# EAGLE schematic moire (EAGLE 9.1.1)

## Sheet 1 of 2
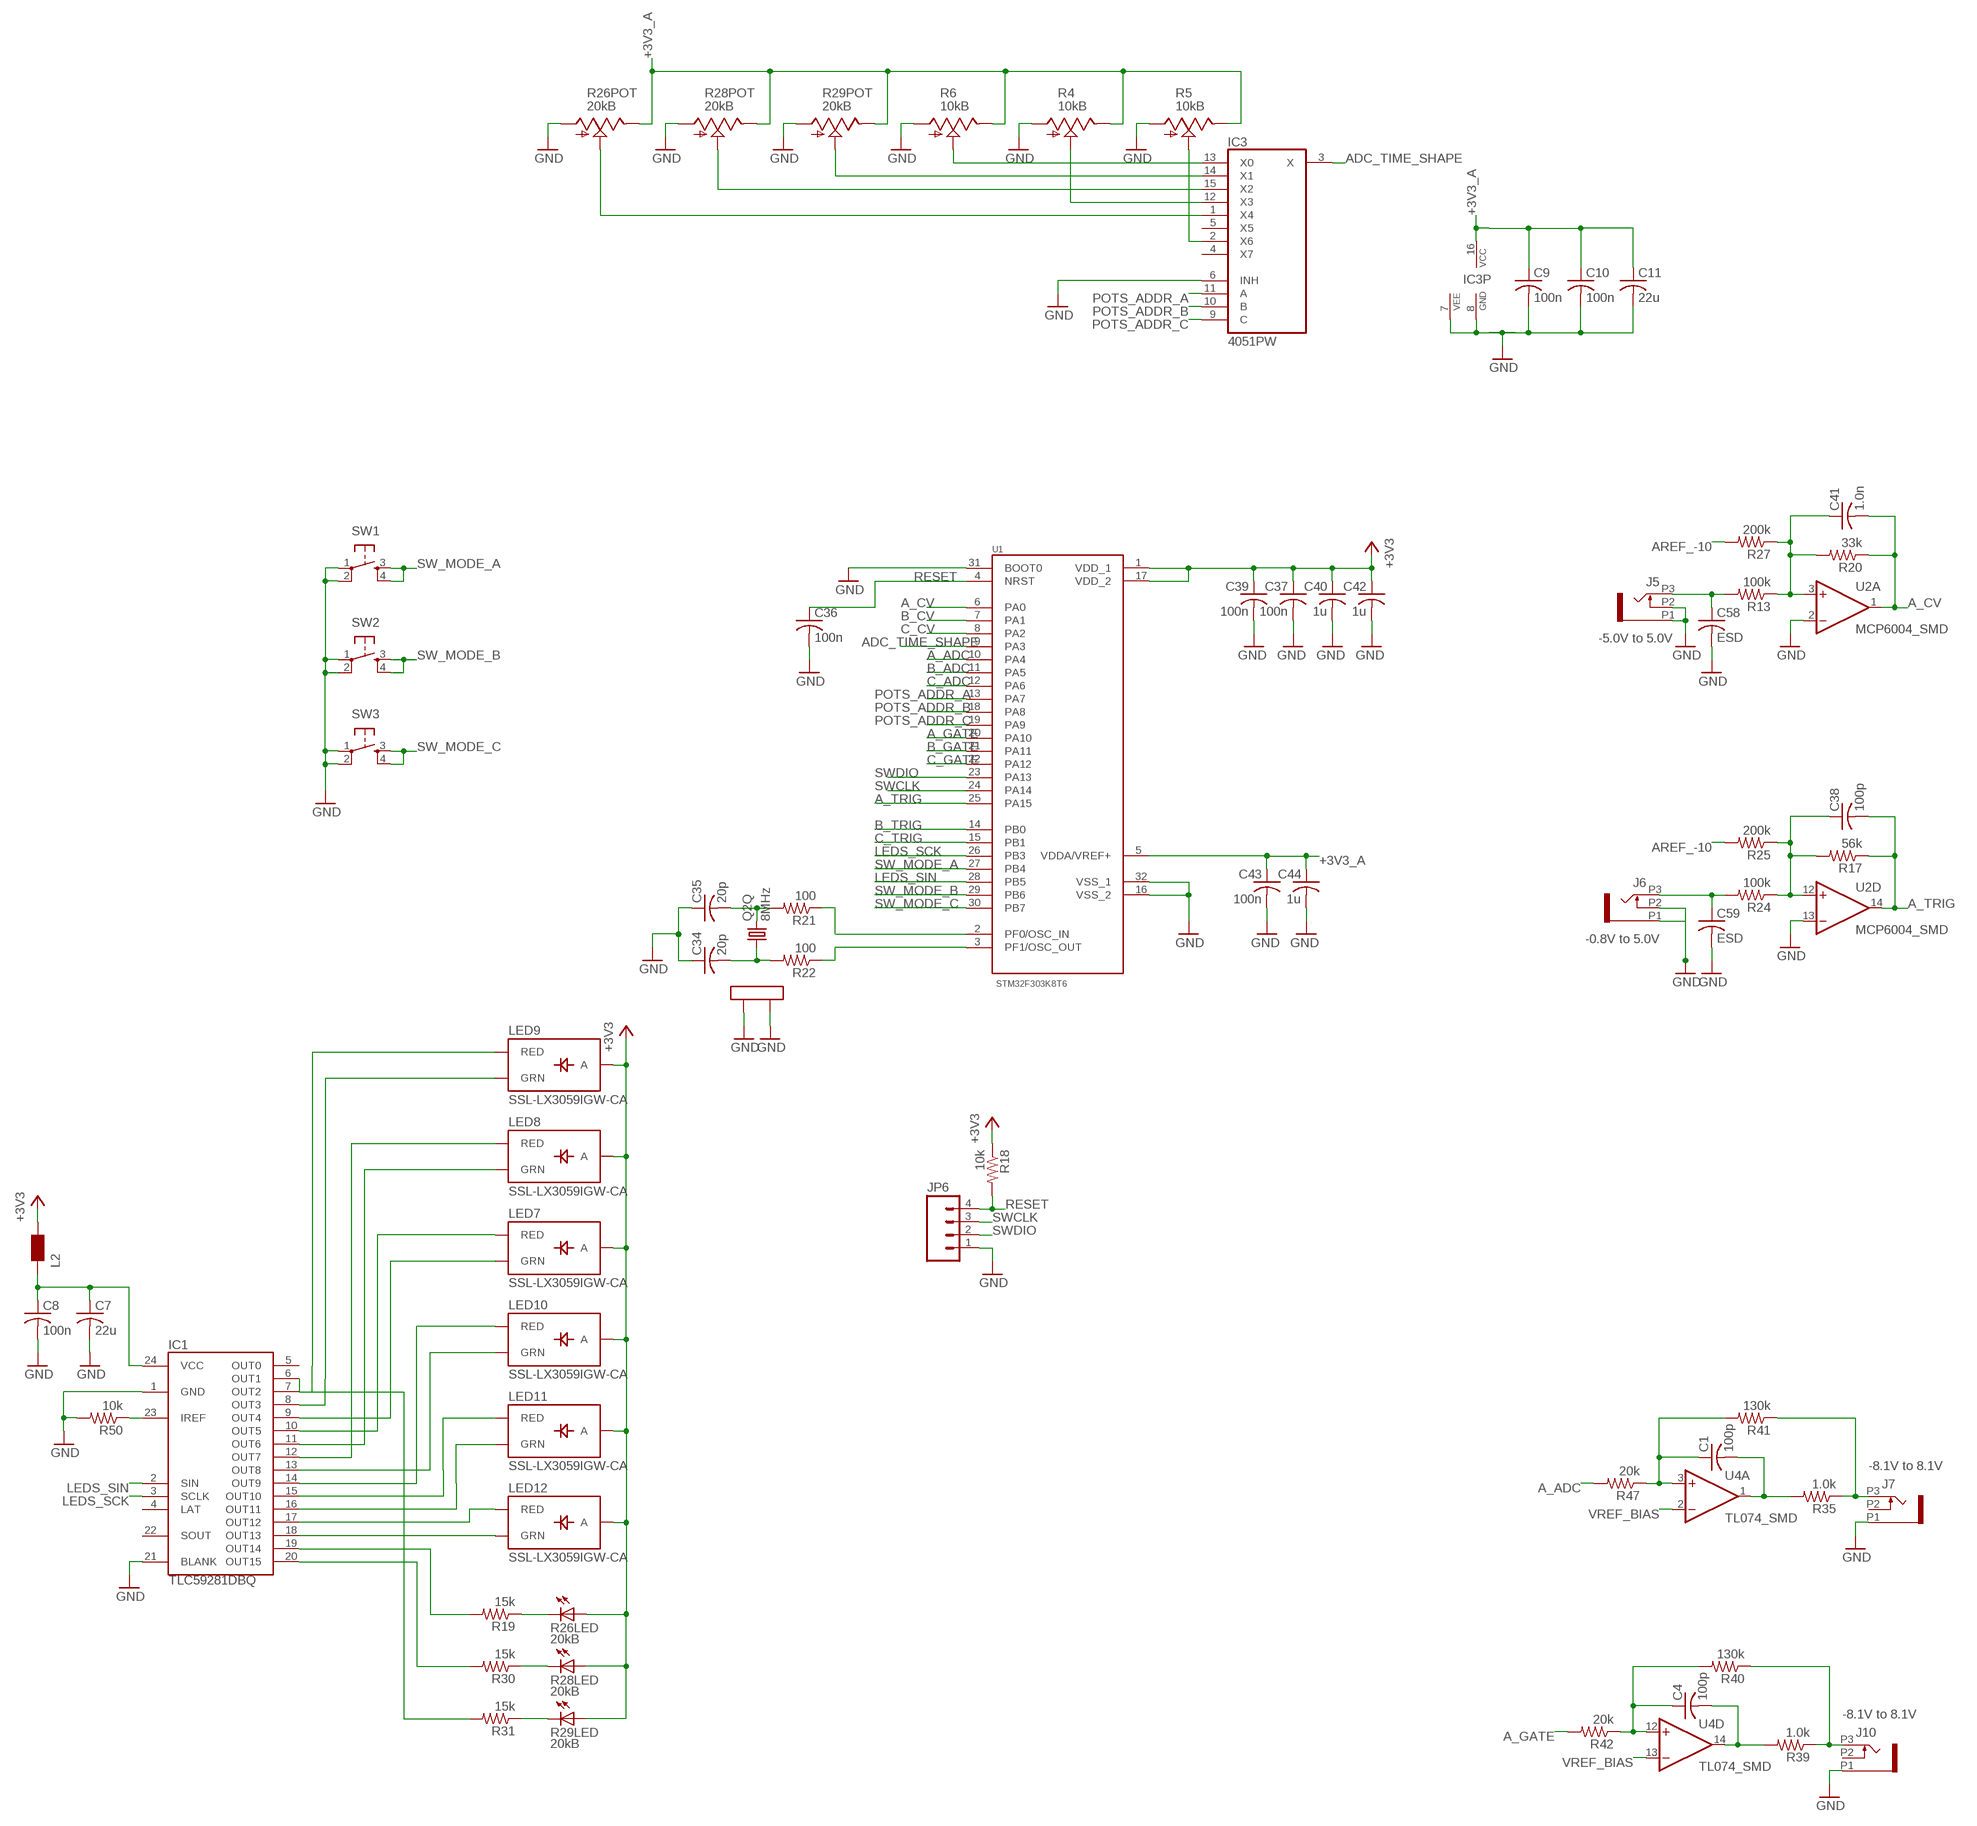
[diagram p0: schematic, sheet 1, part 1 of 2]
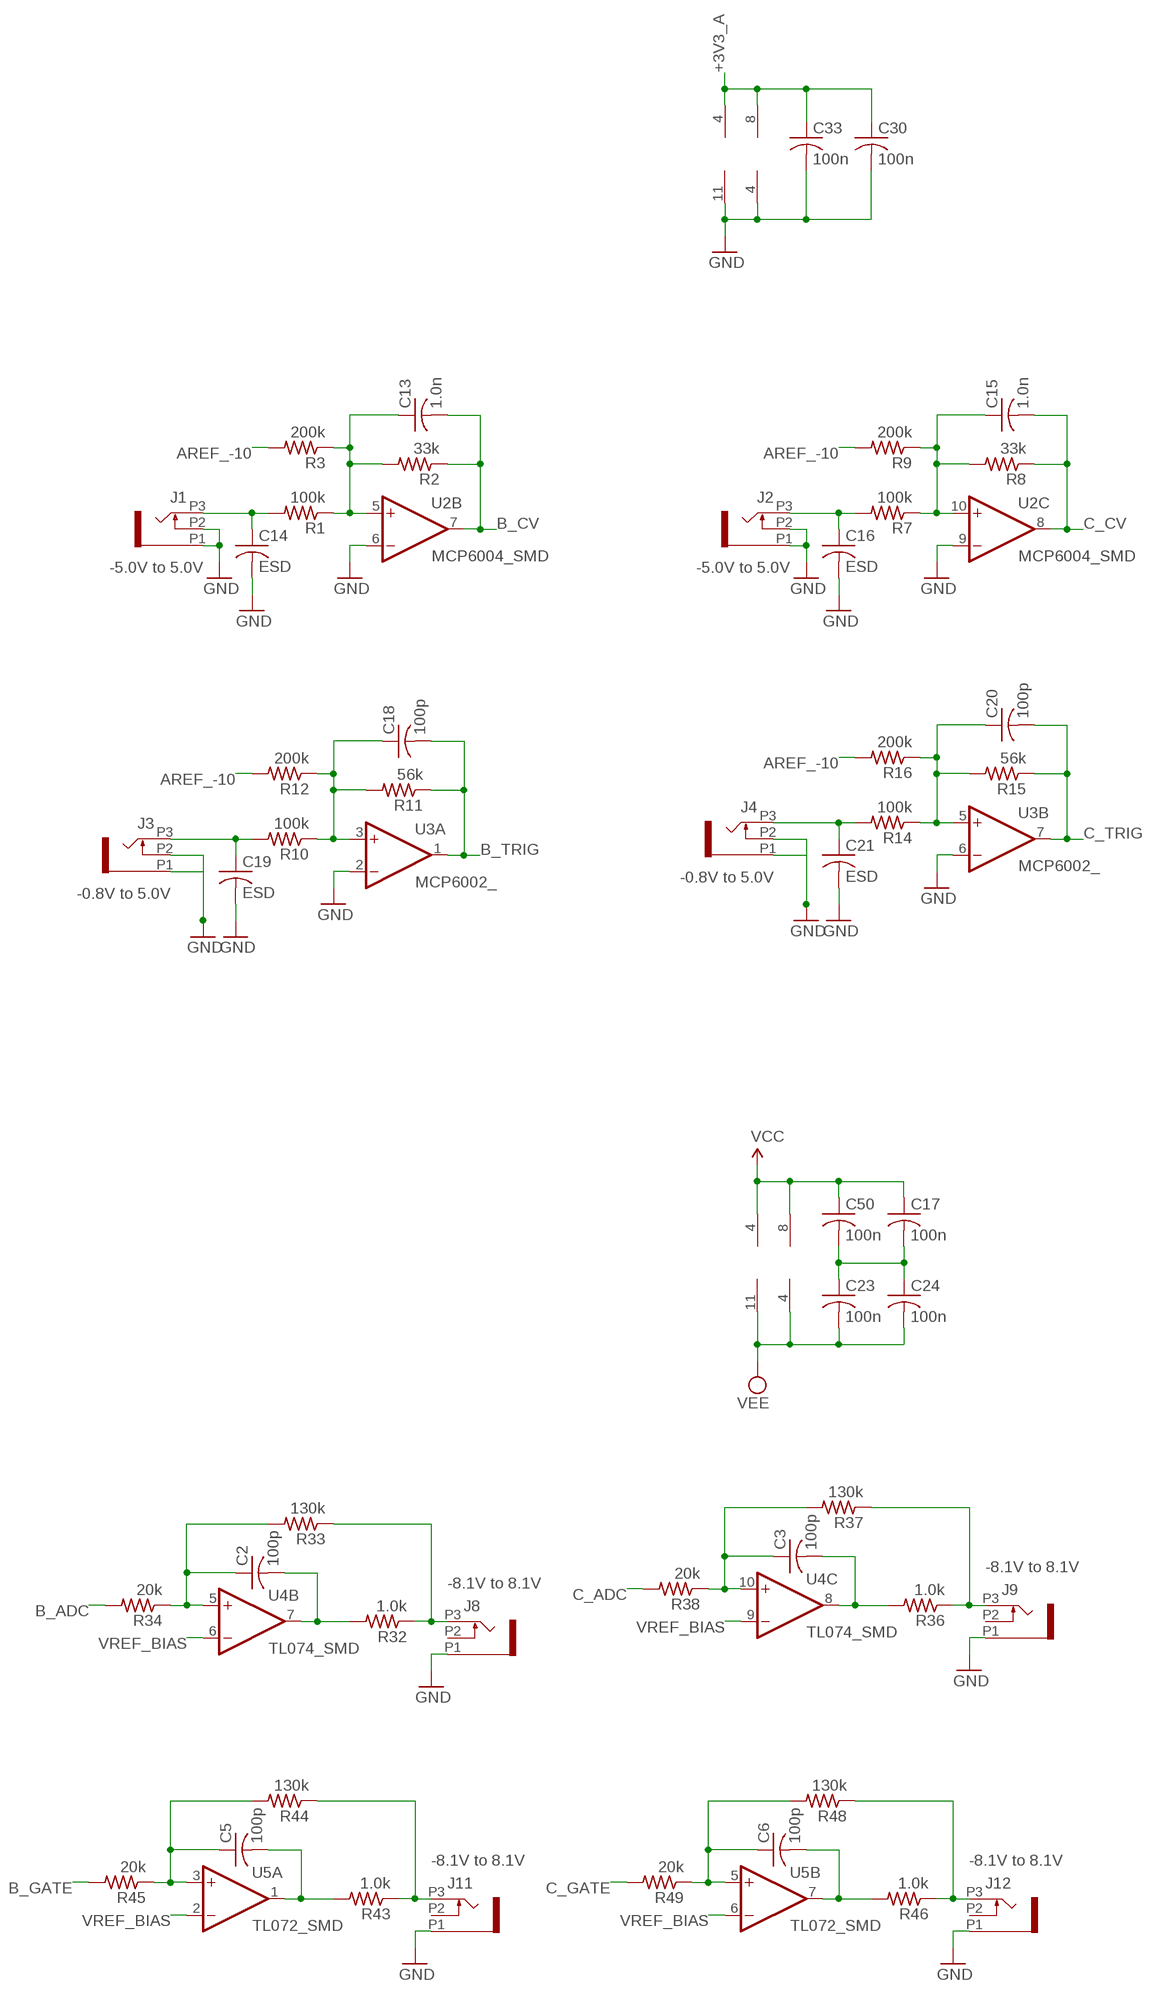
[diagram p1: schematic, sheet 1, part 2 of 2]

### Parts
C1  100p  C-USC0402  [C0402]
C2  100p  C-USC0402  [C0402]
C3  100p  C-USC0402  [C0402]
C4  100p  C-USC0402  [C0402]
C5  100p  C-USC0402  [C0402]
C6  100p  C-USC0402  [C0402]
C7  22u  C-USC1206  [C1206]
C8  100n  C-USC0402  [C0402]
C9  100n  C-USC0402  [C0402]
C10  100n  C-USC0402  [C0402]
C11  22u  C-USC1206  [C1206]
C13  1.0n  C-USC0402  [C0402]
C14  ESD  C-USC0603  [C0603]
C15  1.0n  C-USC0402  [C0402]
C16  ESD  C-USC0603  [C0603]
C17  100n  C-USC0402  [C0402]
C18  100p  C-USC0402  [C0402]
C19  ESD  C-USC0603  [C0603]
C20  100p  C-USC0402  [C0402]
C21  ESD  C-USC0603  [C0603]
C23  100n  C-USC0402  [C0402]
C24  100n  C-USC0402  [C0402]
C30  100n  C-USC0402  [C0402]
C33  100n  C-USC0402  [C0402]
C34  20p  C-USC0402  [C0402]
C35  20p  C-USC0402  [C0402]
C36  100n  C-USC0402  [C0402]
C37  100n  C-USC0402  [C0402]
C38  100p  C-USC0402  [C0402]
C39  100n  C-USC0402  [C0402]
C40  1u  C-USC0402  [C0402]
C41  1.0n  C-USC0402  [C0402]
C42  1u  C-USC0402  [C0402]
C43  100n  C-USC0402  [C0402]
C44  1u  C-USC0402  [C0402]
C50  100n  C-USC0402  [C0402]
C58  ESD  C-USC0603  [C0603]
C59  ESD  C-USC0603  [C0603]
IC1  TLC59281DBQ  [TSSOP24_0635]
IC3  4051PW  [TSSOP16_065]
J1  PJ301_THONKICONN6  [WQP_PJ_301M6]
J2  PJ301_THONKICONN6  [WQP_PJ_301M6]
J3  PJ301_THONKICONN6  [WQP_PJ_301M6]
J4  PJ301_THONKICONN6  [WQP_PJ_301M6]
J5  PJ301_THONKICONN6  [WQP_PJ_301M6]
J6  PJ301_THONKICONN6  [WQP_PJ_301M6]
J7  PJ301_THONKICONN6  [WQP_PJ_301M6]
J8  PJ301_THONKICONN6  [WQP_PJ_301M6]
J9  PJ301_THONKICONN6  [WQP_PJ_301M6]
J10  PJ301_THONKICONN6  [WQP_PJ_301M6]
J11  PJ301_THONKICONN6  [WQP_PJ_301M6]
J12  PJ301_THONKICONN6  [WQP_PJ_301M6]
JP6  M04PTH  [1X04]
L2  WE-CBF_0603  [0603]
LED7  SSL-LX3059IGW-CA  LED-BICOLOR-THROUGHHOLE-CA  [LED-BICOLOR-THROUGHHOLE-LUMEX]
LED8  SSL-LX3059IGW-CA  LED-BICOLOR-THROUGHHOLE-CA  [LED-BICOLOR-THROUGHHOLE-LUMEX]
LED9  SSL-LX3059IGW-CA  LED-BICOLOR-THROUGHHOLE-CA  [LED-BICOLOR-THROUGHHOLE-LUMEX]
LED10  SSL-LX3059IGW-CA  LED-BICOLOR-THROUGHHOLE-CA  [LED-BICOLOR-THROUGHHOLE-LUMEX]
LED11  SSL-LX3059IGW-CA  LED-BICOLOR-THROUGHHOLE-CA  [LED-BICOLOR-THROUGHHOLE-LUMEX]
LED12  SSL-LX3059IGW-CA  LED-BICOLOR-THROUGHHOLE-CA  [LED-BICOLOR-THROUGHHOLE-LUMEX]
Q2  8MHz  CRYSTAL  [CTS406]
R1  100k  R-US_R0402  [R0402]
R2  33k  R-US_R0402  [R0402]
R3  200k  R-US_R0402  [R0402]
R4  10kB  POT_USVERTICAL_PS  [ALPS_POT_VERTICAL_PS]
R5  10kB  POT_USVERTICAL_PS  [ALPS_POT_VERTICAL_PS]
R6  10kB  POT_USVERTICAL_PS  [ALPS_POT_VERTICAL_PS]
R7  100k  R-US_R0402  [R0402]
R8  33k  R-US_R0402  [R0402]
R9  200k  R-US_R0402  [R0402]
R10  100k  R-US_R0402  [R0402]
R11  56k  R-US_R0402  [R0402]
R12  200k  R-US_R0402  [R0402]
R13  100k  R-US_R0402  [R0402]
R14  100k  R-US_R0402  [R0402]
R15  56k  R-US_R0402  [R0402]
R16  200k  R-US_R0402  [R0402]
R17  56k  R-US_R0402  [R0402]
R18  10k  R-US_R0402  [R0402]
R19  15k  R-US_R0402  [R0402]
R20  33k  R-US_R0402  [R0402]
R21  100  R-US_R0402  [R0402]
R22  100  R-US_R0402  [R0402]
R24  100k  R-US_R0402  [R0402]
R25  200k  R-US_R0402  [R0402]
R26  20kB  BOURNS_SLIDER  [BOURNS_SLIDER]
R27  200k  R-US_R0402  [R0402]
R28  20kB  BOURNS_SLIDER  [BOURNS_SLIDER]
R29  20kB  BOURNS_SLIDER  [BOURNS_SLIDER]
R30  15k  R-US_R0402  [R0402]
R31  15k  R-US_R0402  [R0402]
R32  1.0k  R-US_R0603  [R0603]
R33  130k  R-US_R0402  [R0402]
R34  20k  R-US_R0402  [R0402]
R35  1.0k  R-US_R0603  [R0603]
R36  1.0k  R-US_R0603  [R0603]
R37  130k  R-US_R0402  [R0402]
R38  20k  R-US_R0402  [R0402]
R39  1.0k  R-US_R0603  [R0603]
R40  130k  R-US_R0402  [R0402]
R41  130k  R-US_R0402  [R0402]
R42  20k  R-US_R0402  [R0402]
R43  1.0k  R-US_R0603  [R0603]
R44  130k  R-US_R0402  [R0402]
R45  20k  R-US_R0402  [R0402]
R46  1.0k  R-US_R0603  [R0603]
R47  20k  R-US_R0402  [R0402]
R48  130k  R-US_R0402  [R0402]
R49  20k  R-US_R0402  [R0402]
R50  10k  R-US_R0402  [R0402]
SW1  TAC_SWITCHPTH  [TACTILE-PTH]
SW2  TAC_SWITCHPTH  [TACTILE-PTH]
SW3  TAC_SWITCHPTH  [TACTILE-PTH]
U1  STM32F303K8T6  [QFP80P900X900X160-32N]
U2  MCP6004_SMD  [SO14]
U3  MCP6002_  [SO08]
U4  TL074_SMD  [SO14]
U5  TL072_SMD  [SO08]

### Nets
+3V1: C37.1 C39.1 C40.1 C42.1 U1.1(VDD_1) U1.17(VDD_2) ; supply symbol labelled +3V3
+3V3: L2.2 LED7.A LED8.A LED9.A LED10.A LED11.A LED12.A R18.1 R26.B(LED:A) R28.B(LED:A) R29.B(LED:A) ; also sheet 2
+3V3_A: C9.1 C10.1 C11.1 C30.1 C33.1 C43.1 C44.1 IC3.16(VCC) R4.P$1(E) R5.P$1(E) R6.P$1(E) R26.3(POT:E) R28.3(POT:E) R29.3(POT:E) U1.5(VDDA/VREF+) U2.4(P:V+) U3.8(P:V+) ; also sheet 2
A_ADC: R47.2 U1.10(PA4)
A_CV: C41.2 R20.1 U1.6(PA0) U2.1(A:OUT)
A_GATE: R42.2 U1.20(PA10)
A_TRIG: C38.2 R17.1 U1.25(PA15) U2.14(D:OUT)
ADC_TIME_SHAPE: IC3.3(X) U1.9(PA3)
AREF_-10: R3.2 R9.2 R12.2 R16.2 R25.2 R27.2 ; also sheet 2
B_ADC: R34.2 U1.11(PA5)
B_CV: C13.2 R2.1 U1.7(PA1) U2.7(B:OUT)
B_GATE: R45.2 U1.21(PA11)
B_TRIG: C18.2 R11.1 U1.14(PB0) U3.1(A:OUT)
C_ADC: R38.2 U1.12(PA6)
C_CV: C15.2 R8.1 U1.8(PA2) U2.8(C:OUT)
C_GATE: R49.2 U1.22(PA12)
C_TRIG: C20.2 R15.1 U1.15(PB1) U3.7(B:OUT)
GATE_IN1: C59.1 J6.P3 R24.2
GATE_IN2: C19.1 J3.P3 R10.2
GATE_IN3: C21.1 J4.P3 R14.2
GND: C7.2 C8.2 C9.2 C10.2 C11.2 C14.2 C16.2 C19.2 C21.2 C30.2 C33.2 C34.1 C35.1 C36.2 C37.2 C39.2 C40.2 C42.2 C43.2 C44.2 C58.2 C59.2 IC1.1(GND) IC1.21(BLANK) IC3.6(INH) IC3.7(VEE) IC3.8(GND) J1.P1 J1.P2 J2.P1 J2.P2 J3.P1 J3.P2 J4.P1 J4.P2 J5.P1 J5.P2 J6.P1 J6.P2 J7.P1 J8.P1 J9.P1 J10.P1 J11.P1 J12.P1 JP6.1 Q2.2(LID1) Q2.4(LID2) R4.P$3(A) R5.P$3(A) R6.P$3(A) R26.1(POT:A) R28.1(POT:A) R29.1(POT:A) R50.2 SW1.1 SW1.2 SW2.1 SW2.2 SW3.1 SW3.2 U1.16(VSS_2) U1.31(BOOT0) U1.32(VSS_1) U2.2(A:-IN) U2.6(B:-IN) U2.9(C:-IN) U2.11(P:V-) U2.13(D:-IN) U3.2(A:-IN) U3.4(P:V-) U3.6(B:-IN) ; also sheet 2
HARMONICS_IN: C58.1 J5.P3 R13.2
HARMONICS_IN1: C14.1 J1.P3 R1.2
HARMONICS_IN2: C16.1 J2.P3 R7.2
LEDS_SCK: IC1.3(SCLK) U1.26(PB3)
LEDS_SIN: IC1.2(SIN) U1.28(PB5)
N$1: R29.E(LED:C) R31.1
N$2: C13.1 R1.1 R2.2 R3.1 U2.5(B:+IN)
N$3: C15.1 R7.1 R8.2 R9.1 U2.10(C:+IN)
N$4: C18.1 R10.1 R11.2 R12.1 U3.3(A:+IN)
N$5: C38.1 R17.2 R24.1 R25.1 U2.12(D:+IN)
N$6: C20.1 R14.1 R15.2 R16.1 U3.5(B:+IN)
N$7: J8.P3 R32.1 R33.1
N$8: C2.1 R33.2 R34.1 U4.5(B:+IN)
N$9: R21.1 U1.2(PF0/OSC_IN)
N$10: R22.1 U1.3(PF1/OSC_OUT)
N$11: C35.2 Q2.3 R21.2
N$12: C34.2 Q2.1 R22.2
N$19: C2.2 R32.2 U4.7(B:OUT)
N$20: J9.P3 R36.1 R37.1
N$21: C3.1 R37.2 R38.1 U4.10(C:+IN)
N$22: C3.2 R36.2 U4.8(C:OUT)
N$23: J10.P3 R39.1 R40.1
N$24: C4.1 R40.2 R42.1 U4.12(D:+IN)
N$25: C4.2 R39.2 U4.14(D:OUT)
N$26: J11.P3 R43.1 R44.1
N$27: C5.1 R44.2 R45.1 U5.3(A:+IN)
N$28: C5.2 R43.2 U5.1(A:OUT)
N$29: J12.P3 R46.1 R48.1
N$30: C6.1 R48.2 R49.1 U5.5(B:+IN)
N$31: C6.2 R46.2 U5.7(B:OUT)
N$32: IC1.11(OUT6) LED8.GREEN_C(GRN)
N$33: IC1.10(OUT5) LED7.RED_C(RED)
N$34: IC1.12(OUT7) LED8.RED_C(RED)
N$35: IC1.7(OUT2) LED9.RED_C(RED)
N$36: IC1.8(OUT3) LED9.GREEN_C(GRN)
N$37: IC1.15(OUT10) LED11.RED_C(RED)
N$38: IC1.16(OUT11) LED11.GREEN_C(GRN)
N$39: IC1.13(OUT8) LED10.GREEN_C(GRN)
N$40: IC1.17(OUT12) LED12.RED_C(RED)
N$41: C41.1 R13.1 R20.2 R27.1 U2.3(A:+IN)
N$42: IC1.18(OUT13) LED12.GREEN_C(GRN)
N$43: IC1.14(OUT9) LED10.RED_C(RED)
N$44: C7.1 C8.1 IC1.24(VCC) L2.1
N$45: IC1.19(OUT14) R19.2
N$46: IC1.20(OUT15) R30.2
N$47: IC1.6(OUT1) R31.2
N$48: IC3.1(X4) R26.2(POT:S)
N$49: R28.E(LED:C) R30.1
N$50: R19.1 R26.E(LED:C)
N$51: IC3.2(X6) R5.P$2(S)
N$52: C17.2 C23.1 C24.1 C50.2
N$53: IC3.12(X3) R4.P$2(S)
N$54: IC3.13(X0) R6.P$2(S)
N$55: IC3.14(X1) R29.2(POT:S)
N$56: IC3.15(X2) R28.2(POT:S)
N$68: IC1.23(IREF) R50.1
N$86: J7.P3 R35.1 R41.1
N$87: C1.1 R41.2 R47.1 U4.3(A:+IN)
N$93: C1.2 R35.2 U4.1(A:OUT)
N$101: IC1.9(OUT4) LED7.GREEN_C(GRN)
POTS_ADDR_A: IC3.11(A) U1.13(PA7)
POTS_ADDR_B: IC3.10(B) U1.18(PA8)
POTS_ADDR_C: IC3.9(C) U1.19(PA9)
RESET: C36.1 JP6.4 R18.2 U1.4(NRST)
SW_MODE_A: SW1.3 SW1.4 U1.27(PB4)
SW_MODE_B: SW2.3 SW2.4 U1.29(PB6)
SW_MODE_C: SW3.3 SW3.4 U1.30(PB7)
SWCLK: JP6.3 U1.24(PA14)
SWDIO: JP6.2 U1.23(PA13)
VCC: C17.1 C50.1 U4.4(P:V+) U5.8(P:V+) ; also sheet 2
VEE: C23.2 C24.2 U4.11(P:V-) U5.4(P:V-) ; also sheet 2
VREF_BIAS: U4.2(A:-IN) U4.6(B:-IN) U4.9(C:-IN) U4.13(D:-IN) U5.2(A:-IN) U5.6(B:-IN)
Unconnected: IC1.4(LAT) IC1.5(OUT0) IC1.22(SOUT) IC3.4(X7) IC3.5(X5) J7.P2 J8.P2 J9.P2 J10.P2 J11.P2 J12.P2

### Notes on the sheet
- -5.0V to 5.0V
- -5.0V to 5.0V | -5.0V to 5.0V
- -0.8V to 5.0V
- -0.8V to 5.0V
- -0.8V to 5.0V
- -8.1V to 8.1V
- -8.1V to 8.1V | -8.1V to 8.1V
- -8.1V to 8.1V | -8.1V to 8.1V
- -8.1V to 8.1V

## Sheet 2 of 2
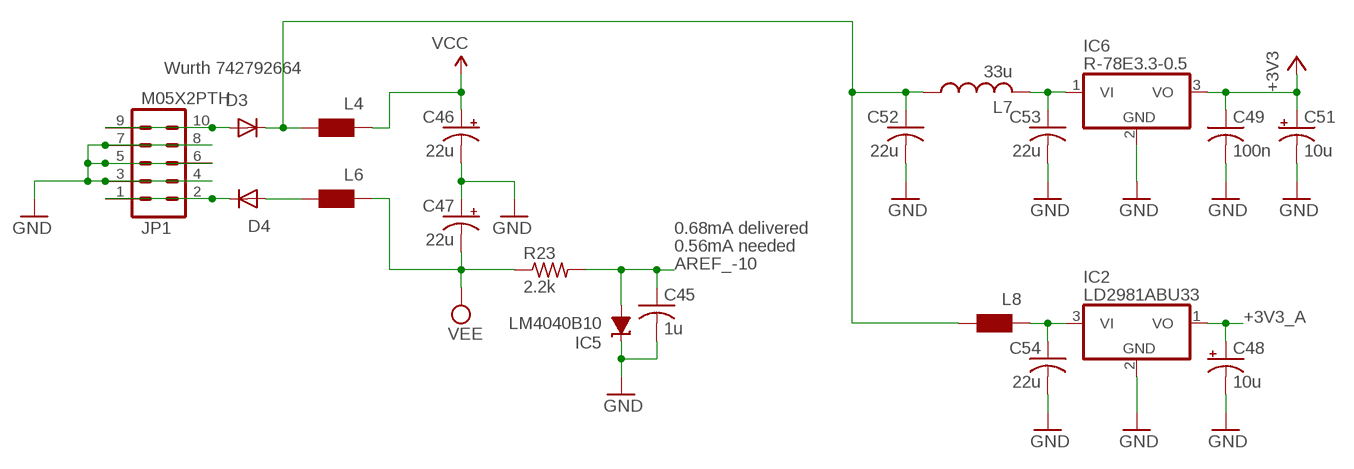
[diagram p2: schematic, sheet 2]

### Parts
C45  1u  C-USC0402  [C0402]
C46  22u  CPOL-USB  [PANASONIC_B]
C47  22u  CPOL-USB  [PANASONIC_B]
C48  10u  CPOL-USA  [PANASONIC_A]
C49  100n  C-USC0402  [C0402]
C51  10u  CPOL-USA  [PANASONIC_A]
C52  22u  C-USC1206  [C1206]
C53  22u  C-USC1206  [C1206]
C54  22u  C-USC1206  [C1206]
D3  1N5819HW  DIODE-SOD123  [SOD123]
D4  1N5819HW  DIODE-SOD123  [SOD123]
IC2  LD2981ABU33  LD2981ABU  [SOT89]
IC5  LM4040B10  LM4041B12DBZ  [DBZ_R-PDSO-G3]
IC6  R-78E3.3-0.5  WE173950378  [WE78]
JP1  M05X2PTH  [2X5-PTH]
L4  WE-CBF_0603  [0603]
L6  WE-CBF_0603  [0603]
L7  33u  L-USL2012C  [L2012C]
L8  WE-CBF_0603  [0603]
R23  2.2k  R-US_R0402  [R0402]

### Nets
+3V3: C49.1 C51.+ IC6.3(VO) ; also sheet 1
+3V3_A: C48.+ IC2.1(VO) ; also sheet 1
AREF_-10: C45.1 IC5.2(A) R23.2 ; also sheet 1
GND: C45.2 C46.- C47.+ C48.- C49.2 C51.- C52.2 C53.2 C54.2 IC2.2(GND) IC5.1(C) IC6.2(GND) JP1.3 JP1.4 JP1.5 JP1.6 JP1.7 JP1.8 ; also sheet 1
N$13: D3.A JP1.9 JP1.10
N$14: D4.C JP1.1 JP1.2
N$15: C53.1 IC6.1(VI) L7.2
N$16: D4.A L6.2
N$17: C52.1 D3.C L4.2 L7.1 L8.2
N$18: C54.1 IC2.3(VI) L8.1
VCC: C46.+ L4.1 ; also sheet 1
VEE: C47.- L6.1 R23.1 ; also sheet 1

### Notes on the sheet
- Wurth 742792664
- 0.68mA delivered
- 0.56mA needed

## Library data of the parts
C1-C11 C13-C21 C23 C24 C30 C33-C45 C49 C50 C52-C54 C58 C59 = rcl:C-US: CAPACITOR, American symbol
C46-C48 C51 = rcl:CPOL-US: POLARIZED CAPACITOR, American symbol
D3 D4 = diode:DIODE-: DIODE
IC1 = og-ics:TLC59281
IC2 = og-vreg:LD2981
IC3 = og-ics:4051: 8-channel ANALOG MULTIPLEXER
IC5 = texas:LM4041: PRECISION MICROPOWER SHUNT VOLTAGE REFERENCE Source: http://focus.ti.com/lit/ds/slcs146e/slcs146e.pdf
IC6 = og-vreg:WE173950378
J1-J12 = og-pj301_variations:PJ301_THONKICONN
JP1 = og-header:M05X2: Header 5x2 Standard 10-pin dual row 0.1" header. Commonly used with AVR-ISP. Use with Spark Fun Electronics SKU: PRT-00778
JP6 = SparkFun:M04: Header 4 Standard 4-pin 0.1" header. Use with straight break away headers (SKU : PRT-00116), right angle break away headers (PRT-00553), swiss pins (PRT-00743), machine pins (PRT-00117), and female headers (PRT-00115). Molex polarized connector foot print use with SKU : PRT-08231 with associated crimp pins and housings.
L2 L4 L6 L8 = wuerth-elektronik:WE-CBF: SMD EMI Suppression Ferrite Beads - excellent anti-EMI properties - low DCR - impedances till 3000 ohms - rated current up to 6 A
L7 = og-rcl:L-US
LED7-LED12 = og-leds:LED-BICOLOR-THROUGHHOLE-CA
Q2 = og-crystal:CRYSTAL: Crystal with 2 extra terminals for the metal LID (Abracon ABMM2 for example)
R1-R3 R7-R25 R27 R30-R50 = rcl:R-US_: RESISTOR, American symbol
R4-R6 = og-pots:POT_US
R26 R28 R29 = og-pots:BOURNS_SLIDER
SW1-SW3 = SparkFun:TAC_SWITCH: Momentary Switch Button commonly used for reset or general input. Spark Fun Electronics SKU : COM-00097
U1 = STM32F303K8T6:STM32F303K8T6: Analog and DSP with FPU ARM Cortex-M4 MCU with 64 Kbytes Flash, 72 MHz CPU, CCM, 12-bit ADC 5 MSPS, comparators, op-amp; AVAILABILITY: Unavailable; DESCRIPTION: Analog and DSP with FPU ARM Cortex-M4 MCU with 64 Kbytes Flash, 72 MHz CPU, CCM, 12-bit ADC 5 MSPS, comparators, op-amp; MF: STMicroelectronics; MP: STM32F303K8T6; PACKAGE: LQFP-32 STMicroelectronics; PRICE: None
U2 = MusicThingModular:MCP6004: Generic Quad Op Amp
U3 = MusicThingModular:MCP6002: Generic Dual Op Amp
U4 = MusicThingModular:TL074: Generic Quad Op Amp
U5 = MusicThingModular:TL072: Generic Dual Op Amp